# Altium schematic sheet ADC_Buffer.SchDoc: =ProjectName
size 420 x 297 mm; Author: SBH; CompanyName: WUT; DrawnBy: SBH; Organization: ISE-WUT; Address1: Warsaw Univeristy of Technology; Address2: Nowowiejska 15/19; Revision: -; SheetNumber: -; SheetTotal: -; EDA_Number: ARTIQ; Projet: ADC/DAC MEZZANINE; ModifiedBy: -; CreateDate: XX/XX/XXXX; CheckedDate: -; Title2: ADC_Buffer.SchDoc; DivGrp: ISE; Designer: SBH; ModifiedDate: -; ProjectName: ADC/DAC MEZZANINE
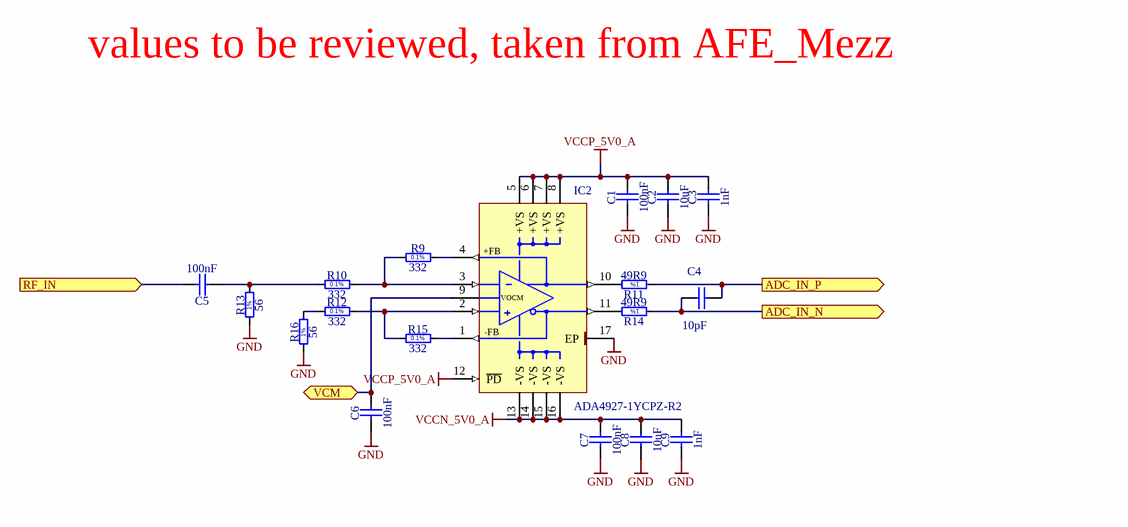
[diagram p0: ADC_Buffer.SchDoc]

## Parts
C1  100nF  [CAPC1005X55N]
C2  10uF  [CAPC1608X87N]
C3  1nF  [CAPC1005X55N]
C4  10pF  [CAPC1608X87N]
C5  100nF  [CAPC1005X55N]
C6  100nF  [CAPC1005X55N]
C7  100nF  [CAPC1005X55N]
C8  10uF  [CAPC1608X87N]
C9  1nF  [CAPC1005X55N]
IC2  ADA4927-1YCPZ-R2  [QFN50P300X300X100-17N-S145]
R9  332  [RESC1608X55N]
R10  332  [RESC1608X55N]
R11  49R9  [RESC1005X40N]
R12  332  [RESC1608X55N]
R13  56  [RESC1005X40N]
R14  49R9  [RESC1005X40N]
R15  332  [RESC1608X55N]
R16  56  [RESC1005X40N]

## Ports
ADC_IN_N (out), ADC_IN_P (out), RF_IN (in), VCM (bidir)

## Nets
GND: C1.1 C2.1 C3.1 C6.1 C7.1 C8.1 C9.1 IC2.17(EP) R13.1 R16.1
VCCN_5V0_A: C7.2 C8.2 C9.2 IC2.13(-VS) IC2.14(-VS) IC2.15(-VS) IC2.16(-VS)
VCCP_5V0_A: C1.2 C2.2 C3.2 IC2.5(+VS) IC2.6(+VS) IC2.7(+VS) IC2.8(+VS) IC2.12(~{PD})
ADC_IN_N: C4.1 R14.1 ; port ADC_IN_N
ADC_IN_P: C4.2 R11.1 ; port ADC_IN_P
RF_IN: C5.2 ; port RF_IN
VCM: C6.2 IC2.9(VOCM) ; port VCM
NetC5_1: C5.1 R10.1 R13.2
NetIC2_1: IC2.1(-FB) R15.2
NetIC2_2: IC2.2(+IN) R12.2 R15.1
NetIC2_3: IC2.3(-IN) R9.1 R10.2
NetIC2_4: IC2.4(+FB) R9.2
NetIC2_10: IC2.10(+OUT) R11.2
NetIC2_11: IC2.11(-OUT) R14.2
NetR12_1: R12.1 R16.2

## Notes on the sheet
- values to be reviewed, taken from AFE_Mezz
- Project/Equipment
- Designer
- Drawn by
- Check.by
- File
- Last Mod.
- Print Date
- Sheet
- Size
- A3
- of
- Rev
- (in symbol R0402_49R9_1%_0.0625W_100PPM) 1%
- (in symbol R0402_56R_1%_0.0625W_100PPM) 1%
- (in symbol R0603_332R_0.1%_0.063W_10PPM) 0.1%

## Library data of the parts
C1 C5-C7 = CC0402_100NF_16V_10%_X5R: Non-polarised capacitor; Part Description: SMD Multilayer Chip Ceramic Capacitor; Manufacturer: GENERIC; Manufacturer1 Part Number: GRM155R61C104KA88D; Voltage: 16V; TC: X5R; Tolerance: ±10%; Part Number: CC0402_100NF_16V_10%_X5R; Component Kind: Standard; Component Type: Standard; Pin Count: 2; Value: 100nF; Status: None; Manufacturer Part Number: CC0402_100NF_16V_10%_X5R; Case: 0402; Mounted: Yes; Socket: No; SMD: Yes; Sense: No; Manufacturer1 Example: MURATA; Manufacturer1 ComponentHeight: 0.55mm; HelpURL: \\cern.ch\dfs\Applications\Altium\Datasheets\CC0402_X5R_MURATA_GRM.pdf; Author: CERN DEM JLC; CreateDate: 10.12.2013; LatestRevisionDate: 10.12.2013
C2 C8 = CC0603_10UF_6.3V_20%_X5R: Non-polarised capacitor; Part Description: SMD Multilayer Chip Ceramic Capacitor; Manufacturer: GENERIC; Manufacturer1 Part Number: C0603C106M9PAC; Voltage: 6.3V; TC: X5R; Tolerance: ±20%; Part Number: CC0603_10UF_6.3V_20%_X5R; Component Kind: Standard; Component Type: Standard; Pin Count: 2; Value: 10uF; Status: Preferred; Manufacturer Part Number: CC0603_10uF_6.3V_20%_X5R; Case: 0603; Mounted: Yes; Socket: No; SMD: Yes; Sense: No; Manufacturer1 Example: KEMET; Manufacturer1 ComponentHeight: 0.95mm; HelpURL: \\cern.ch\dfs\Applications\Altium\Datasheets\CC0603_X5R_KEMET.pdf; Author: CERN DEM JLC; CreateDate: 03.12.2007; LatestRevisionDate: 03.12.2007
C3 C9 = CC0402_1NF_50V_10%_X7R: Non-polarised capacitor; Part Description: SMD Multilayer Chip Ceramic Capacitor; Manufacturer: GENERIC; Manufacturer1 Part Number: 223858715623; Voltage: 50V; TC: X7R; Tolerance: ±10%; Part Number: CC0402_1NF_50V_10%_X7R; Component Kind: Standard; Component Type: Standard; Pin Count: 2; Value: 1nF; Status: Not Recommended; Manufacturer Part Number: CC0402_1NF_50V_10%_X7R; Case: 0402; Mounted: Yes; Socket: No; SMD: Yes; Sense: No; Manufacturer1 Example: PHYCOMP; Manufacturer1 ComponentHeight: 0.55mm; HelpURL: \\cern.ch\dfs\Applications\Altium\Datasheets\CC0402_X7R_PHYCOMP.pdf; Author: CERN DEM JLC; CreateDate: 03.12.2007; LatestRevisionDate: 03.12.2007
C4 = CC0603_10PF_50V_5%_NP0: Non-polarised capacitor; Part Description: SMD Multilayer Chip Ceramic Capacitor; Manufacturer: GENERIC; Manufacturer1 Part Number: 223886715109; Voltage: 50V; TC: C0G/NP0; Tolerance: ±5%; Part Number: CC0603_10PF_50V_5%_NP0; Component Kind: Standard; Component Type: Standard; Pin Count: 2; Value: 10pF; Status: Preferred; Manufacturer Part Number: CC0603_10PF_50V_5%_NP0; Case: 0603; Mounted: Yes; Socket: No; SMD: Yes; Sense: No; Manufacturer1 Example: PHYCOMP; Manufacturer1 ComponentHeight: 0.87mm; HelpURL: \\cern.ch\dfs\Applications\Altium\Datasheets\CC0603_NP0_PHYCOMP.pdf; Author: CERN DEM JLC; CreateDate: 03.12.2007; LatestRevisionDate: 03.12.2007
IC2 = ADA4927-1YCPZ-R2: Ultralow Distortion Current Feedback Differential ADC Driver; Manufacturer: ANALOG DEVICES; PressFit: No; Bonding: No; Part Number: ADA4927-1YCPZ-R2; Component Kind: Standard; Component Type: Standard; Device: ADA4927-1YCPZ-R2; PackageDescription: QFN,0.50mm pitch,square; 4 pin X 4 pin, 3mm X 3mm X 1.00mm H body (w/thermal tab 1.45 X 1.45mm),  IPC Medium Density; Part Description: Ultralow Distortion Current Feedback Differential ADC Driver; Manufacturer Part Number: ADA4927-1YCPZ-R2; Pin Count: 17; Case: QFN16; Mounted: Yes; Socket: No; SMD: Yes; Sense: No; ComponentHeight: 1mm; Author: CERN DEM JLC; HelpURL: \\cern.ch\dfs\Applications\Altium\Datasheets\ADA4927-1YCPZ-R2.pdf; CreateDate: 19.04.2010; LatestRevisionDate: 19.04.2010
R9 R10 R12 R15 = R0603_332R_0.1%_0.063W_10PPM: Resistor - 0.1%; Part Description: Thin Film Chip Resistor; Manufacturer: GENERIC; Manufacturer1 Part Number: RN73C1J332RBTDF; Power: 0.063W; TC: ±10ppm; Part Number: R0603_332R_0.1%_0.063W_10PPM; Component Kind: Standard; Component Type: Standard; Pin Count: 2; Value: 332; Status: Not recommended; Tolerance: ±0.1%; Manufacturer Part Number: R0603_332R_0.1%_0.063W_10PPM; Case: 0603; Mounted: Yes; Sense: No; Socket: No; SMD: Yes; Manufacturer1 Example: TYCO HOLSWORTHY; Manufacturer1 ComponentHeight: 0.5mm; HelpURL: \\cern.ch\dfs\Applications\Altium\Datasheets\R0603_Tyco_RN73.pdf; Author: CERN DEM JLC; CreateDate: 03.12.2007; LatestRevisionDate: 13.03.2008
R11 R14 = R0402_49R9_1%_0.0625W_100PPM: Resistor - 1%; Part Description: General Purpose Thick Film Chip Resistor; Manufacturer: GENERIC; Manufacturer1 Part Number: 232270674999L or RC0402FR-0749R9L; TC: ±100ppm/°C; Part Number: R0402_49R9_1%_0.0625W_100PPM; Component Kind: Standard; Component Type: Standard; Pin Count: 2; Value: 49R9; Status: Not recommended; Power: 0.0625W; Tolerance: ±1%; Manufacturer Part Number: R0402_49R9_1%_0.0625W_100PPM; Case: 0402; Mounted: Yes; Sense: No; Socket: No; SMD: Yes; Manufacturer1 Example: YAGEO PHYCOMP; Manufacturer1 ComponentHeight: 0.4mm; HelpURL: \\cern.ch\dfs\Applications\Altium\Datasheets\R0402_Phycomp_RC0402.pdf; Author: CERN DEM JLC; CreateDate: 24.10.2012; LatestRevisionDate: 24.10.2012
R13 R16 = R0402_56R_1%_0.0625W_100PPM: Resistor - 1%; Part Description: General Purpose Thick Film Chip Resistor; Manufacturer: GENERIC; Manufacturer1 Part Number: 232270675609L; TC: ±100ppm/°C; Part Number: R0402_56R_1%_0.0625W_100PPM; Component Kind: Standard; Component Type: Standard; Pin Count: 2; Value: 56; Status: Not recommended; Power: 0.0625W; Tolerance: ±1%; Manufacturer Part Number: R0402_56R_1%_0.0625W_100PPM; Case: 0402; Mounted: Yes; Sense: No; Socket: No; SMD: Yes; Manufacturer1 Example: YAGEO PHYCOMP; Manufacturer1 ComponentHeight: 0.4mm; HelpURL: \\cern.ch\dfs\Applications\Altium\Datasheets\R0402_Phycomp_RC0402.pdf; Author: CERN DEM JLC; CreateDate: 03.12.2007; LatestRevisionDate: 17.10.2012